# EAGLE schematic schematic-v2 (EAGLE 9.6.2)
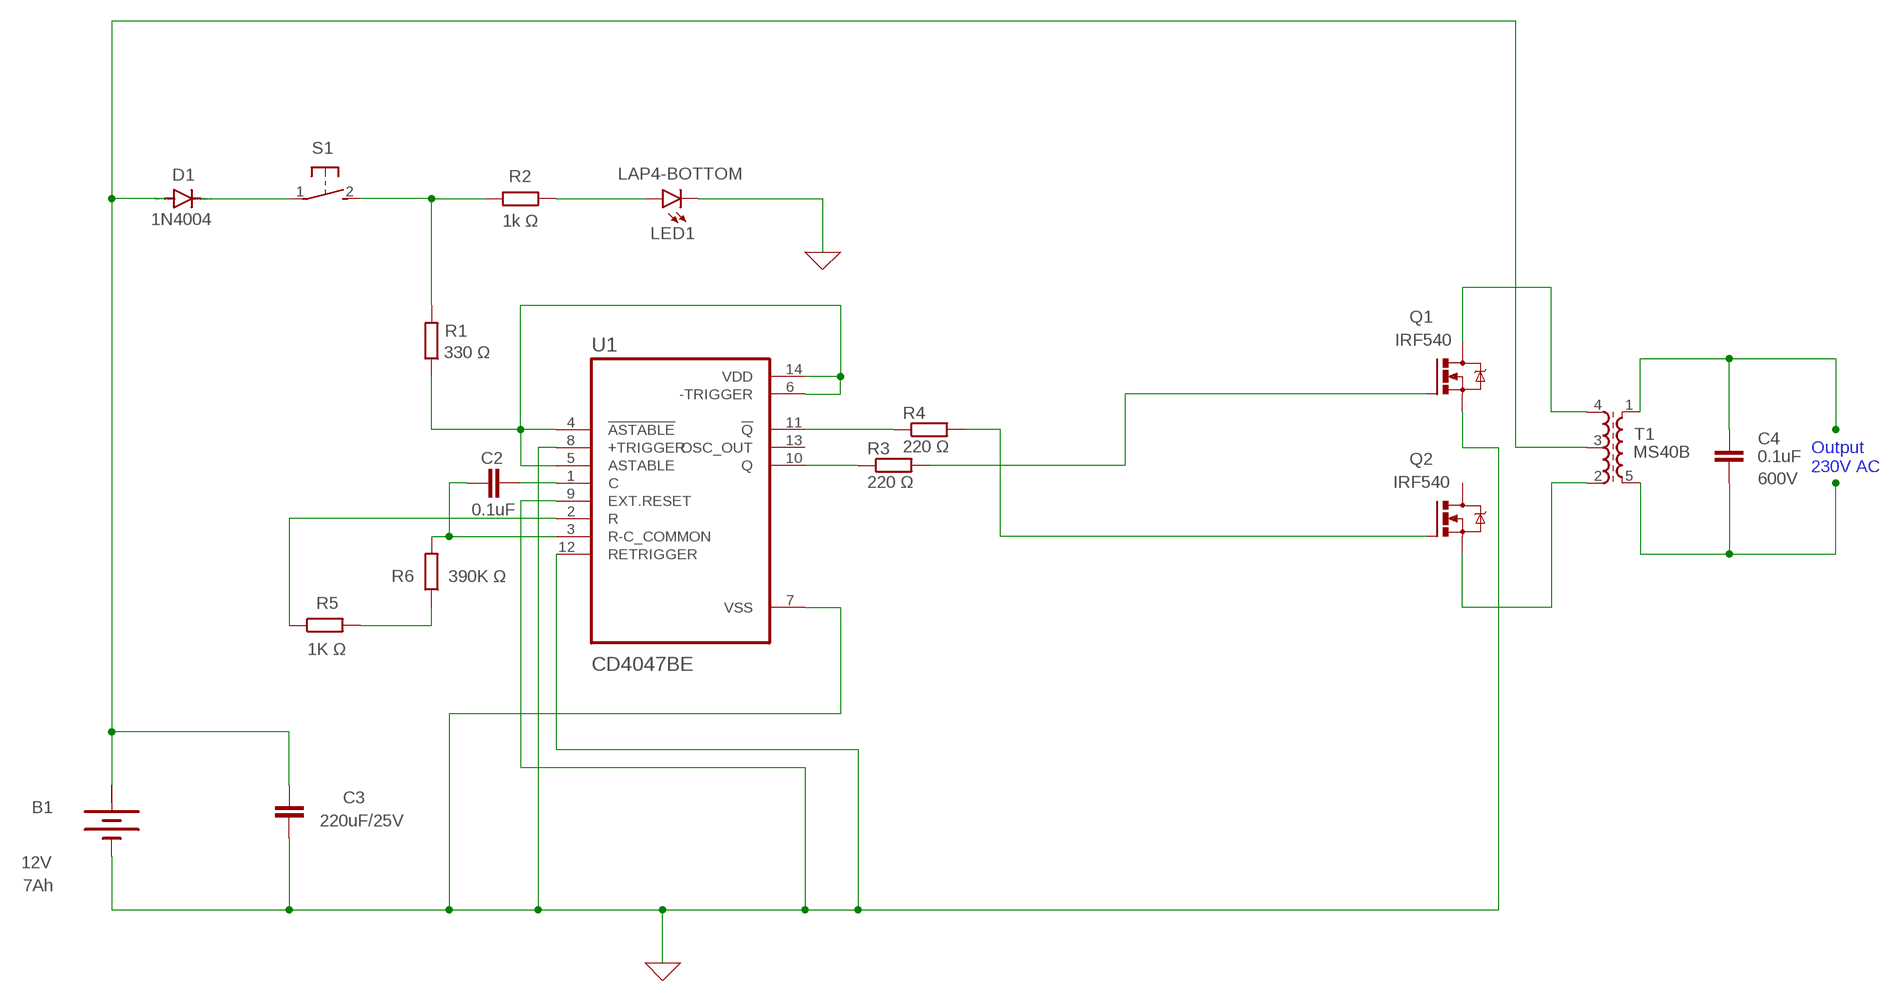
[diagram p0: schematic, sheet 1]

## Parts
B1  12V  BATTERY  [BATTERY]
C2  0.1uF  C2,5-3  [C2.5-3]
C3  220uF/25V  C2,5-3  [C2.5-3]
C4  0.1uF  C2,5-3  [C2.5-3]
D1  1N4004  [DO41-10]
LED1  LAP4-BOTTOM  [P47F-BOTTOM]
Q1  IRF540  [TO220BV]
Q2  IRF540  [TO220BV]
R1  330 Ω  R-EU_0204/7  [0204/7]
R2  1k Ω  R-EU_0204/7  [0204/7]
R3  220 Ω  R-EU_0204/7  [0204/7]
R4  220 Ω  R-EU_0204/7  [0204/7]
R5  1K Ω  R-EU_0204/7  [0204/7]
R6  390K Ω  R-EU_0204/7  [0204/7]
S1  31-XX  [B3F-31XX]
T1  MS40B  [MS40]
U1  CD4047BE  [DIP794W45P254L1969H508Q14]

## Nets
0: B1.- C3.2 LED1.C Q1.S U1.7(VSS) U1.8(+TRIGGER) U1.9(EXT.RESET) U1.12(RETRIGGER) ; supply symbol labelled GND
N$1: C2.2 U1.1(C)
N$2: C2.1 R6.2 U1.3(R-C_COMMON)
N$3: C4.1 T1.1
N$4: C4.2 T1.5
N$5: Q2.S T1.2
N$6: Q1.D T1.4
N$7: B1.+ C3.1 D1.A T1.3
N$8: R5.1 U1.2(R)
N$9: R1.1 U1.4(!ASTABLE) U1.5(ASTABLE) U1.6(-TRIGGER) U1.14(VDD)
N$10: R1.2 R2.2 S1.2(S)
N$11: LED1.A R2.1
N$12: D1.C S1.1(P)
N$13: Q1.G R3.2
N$14: Q2.G R4.2
N$15: R3.1 U1.10(Q)
N$16: R4.1 U1.11(!Q)
N$17: R5.2 R6.1
Unconnected: Q2.D U1.13(OSC_OUT)

## Notes on the sheet
- Output
  230V AC
- 600V
- 7Ah

## Power pins joined to a net without a drawn wire
+: B1.+@1(+)

## Library data of the parts
B1 = special:BATTERY: BATTERY
C2-C4 = capacitor-wima:C: CAPACITOR naming: grid - package width
D1 = diode:1N4004: DIODE general purpose rectifier, 1 A
LED1 = led:*P4: PointLED® Enhanced Thinfilm LED TOP & BOTTOM mount LS P47F, LR P47F, LA P47F, LY P47F, LT P4SG, LB P4SG, LW P4SG Source: http://catalog.osram-os.com .. LA_LR_LS_LY_P47F_Pb_free.pdf
Q1 Q2 = transistor-power:IRF540: HEXFET Power MOSFET
R1-R6 = rcl:R-EU_: RESISTOR, European symbol; SPICEPREFIX: R
S1 = switch-omron:31-XX: OMRON SWITCH; MPN: B3F-3100; OC_FARNELL: 959704; OC_NEWARK: 36M3582
T1 = inductor-neosid:MS40: TRANSFORMER SMD transformer acc. to customer specification; OC_FARNELL: unknown; OC_NEWARK: unknown
U1 = CD4047BE:CD4047BE: Check availability <https://pricing.snapeda.com/parts/CD4047BE/Texas%20Instruments/view-part?ref=eda>; AVAILABILITY: In Stock; CHECK_PRICES: https://www.snapeda.com/parts/CD4047BE/Texas+Instruments/view-part/?ref=eda; DESCRIPTION: CMOS Low-Power Monostable/Astable Multivibrator; MF: Texas Instruments; MP: CD4047BE; PACKAGE: PDIP-14 Texas Instruments; PRICE: None; PURCHASE-URL: https://www.snapeda.com/api/url_track_click_mouser/?unipart_id=105099&manufacturer=Texas Instruments&part_name=CD4047BE&search_term=None; SNAPEDA_LINK: https://www.snapeda.com/parts/CD4047BE/Texas+Instruments/view-part/?ref=snap